# Altium schematic sheet power.SchDoc
size A4; SheetNumber: 5; SheetTotal: 8
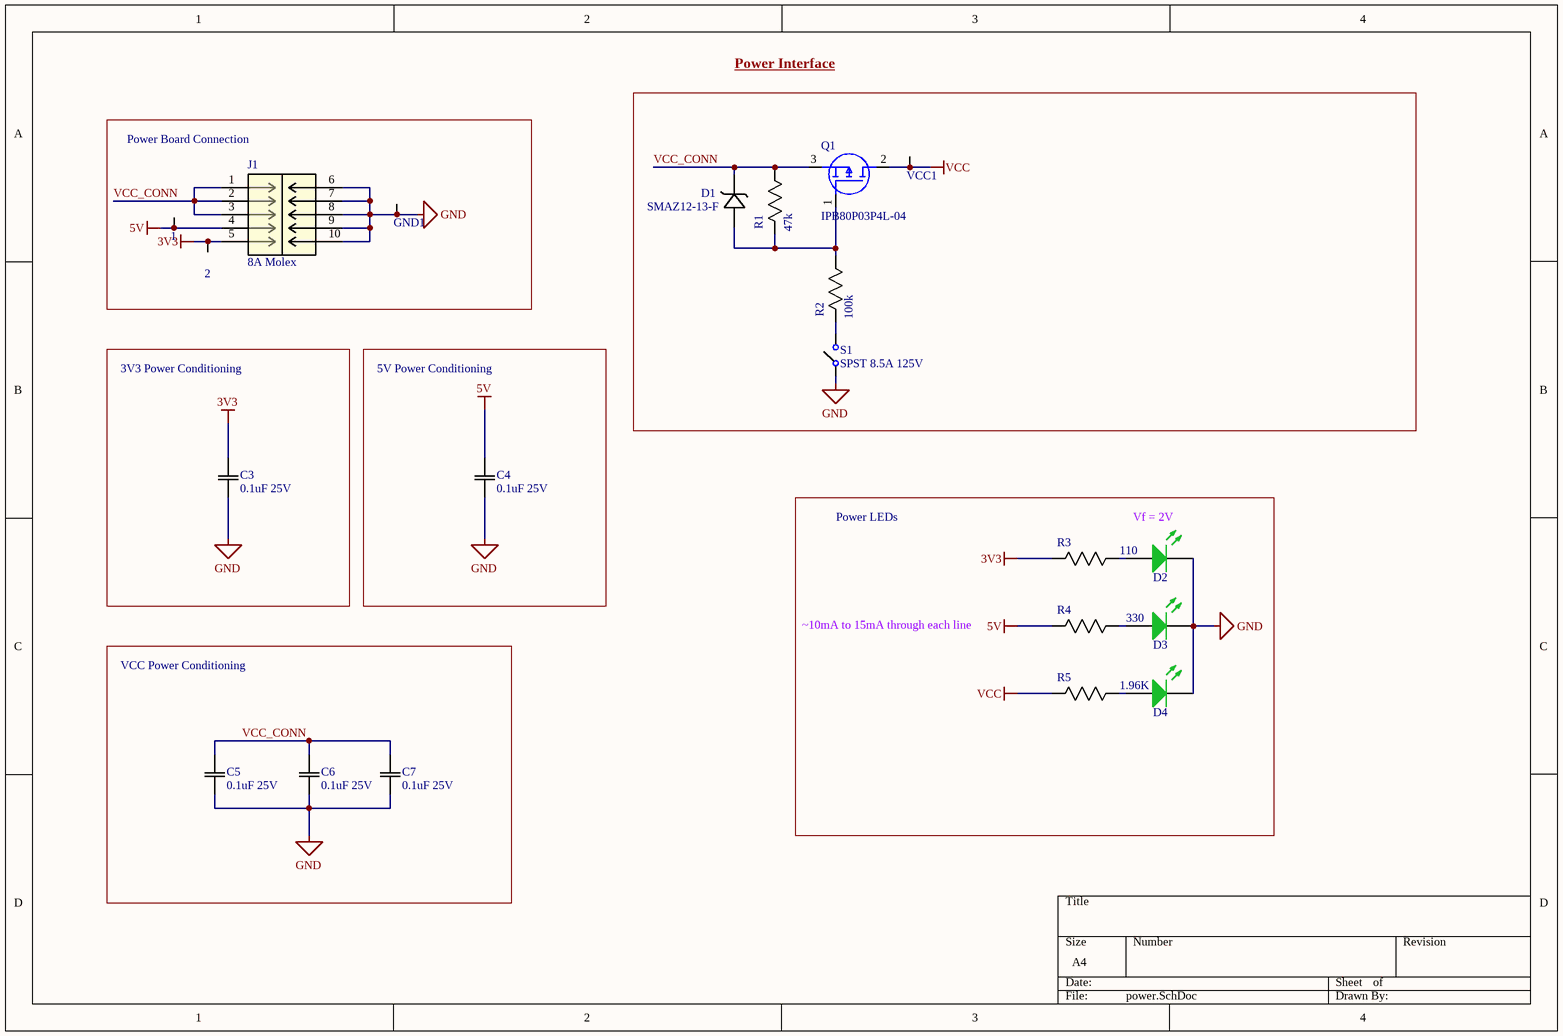
[diagram p0: power.SchDoc]

## Parts
1  Test Point (Via)  [TP]  (value not drawn)
2  Test Point (Via)  [TP]  (value not drawn)
C3  0.1uF 25V  [0805]
C4  0.1uF 25V  [0805]
C5  0.1uF 25V  [0805]
C6  0.1uF 25V  [0805]
C7  0.1uF 25V  [0805]
D1  SMAZ12-13-F  [SMA_DIO-L]
D2  LED2  [3.2X1.6X1.1]  (value not drawn)
D3  LED2  [3.2X1.6X1.1]  (value not drawn)
D4  LED2  [3.2X1.6X1.1]  (value not drawn)
GND1  Test Point (Via)  [TP]  (value not drawn)
J1  8A Molex  [MOLEX_0430451012]
Q1  IPB80P03P4L-04  [IPB80P03P4L04]
R1  47k  [0603]
R2  100k  [0603]
R3  110  [0603]
R4  330  [0603]
R5  1.96K  [0603]
S1  SPST 8.5A 125V  [SPST GF-123-0054]
VCC1  Test Point (Via)  [TP]  (value not drawn)

## Blocks framed on the sheet
Power Board Connection: 1 2 GND1 J1
3V3 Power Conditioning: C3
5V Power Conditioning: C4
VCC Power Conditioning: C5-C7

## Nets
3V3: 2.1 C3.1(C1) J1.5 R3.2(R2)
5V: 1.1 C4.1(C1) J1.4 R4.2(R2)
GND: C3.2(C2) C4.2(C2) C5.2(C2) C6.2(C2) C7.2(C2) D2.2(K) D3.2(K) D4.2(K) GND1.1 J1.6 J1.7 J1.8 J1.9 J1.10 S1.0
VCC: Q1.2(D) R5.2(R2) VCC1.1
VCC_CONN: C5.1(C1) C6.1(C1) C7.1(C1) D1.1 J1.1 J1.2 J1.3 Q1.3(S) R1.1(R1)
NetD1_2: D1.2 Q1.1(G) R1.2(R2) R2.1(R1)
NetD2_1: D2.1(A) R3.1(R1)
NetD3_1: D3.1(A) R4.1(R1)
NetD4_1: D4.1(A) R5.1(R1)
NetR2_2: R2.2(R2) S1.1

## Notes on the sheet
- Power Interface
- Power LEDs
- Vf = 2V
- ~10mA to 15mA through each line

## Library data of the parts
C3-C7 = CAP 0.1uF 25V: CAP CER 0.1UF 25V X7R 0805/0603; Tolerance: 10%; Value: 0.1uF; Temperature Coefficient: X7R; Rating: 25V; Operating Temperature: -55°C ~ 125°C
D1 = DIODE ZENER 12V 1W: Zener Diode 12 V 1 W ±5% Surface Mount SMA; Mfr_Name: Diodes Inc; Type: DEV; Copyright: Copyright (C) 2021 Ultra Librarian. All rights reserved.; Manufacturer_Part_Number: SMAZ12-13-F; Digi-Key_Part_Number_1: SMAZ12-FDICT-ND; Digi-Key_Part_Number_2: SMAZ12-FDIDKR-ND; Digi-Key_Part_Number_3: SMAZ12-FDITR-ND; RefDes: RefDes; Supplier 1: Mouser; Supplier 2: Newark; Supplier 3: Digi-Key; Supplier Part Number 1: 621-SMAZ12-F; Supplier Part Number 2: 23T8541; Supplier Part Number 3: SMAZ12-FDICT-ND
D2-D4 = LED GREEN SMD: Typical RED, GREEN, YELLOW, AMBER GaAs LED; Voltage - Forward (Vf) (Typ): 2V; Lens Transparency: Clear; Current - Test: 20mA; Package: 1206; Color: Green
J1 = CN HDR 10POS MOLEX 0430451012: CONN HEADER VERT 10POS 3MM; Number of Terminals/Pins: 10; Contact Resistance: 10mR; Connector Type: Male Pin; Number of Ports: 1; Max Voltage Rating (AC): 250V; Pitch: 0.118inch; Supplier 1: Digi-Key; Manufacturer: Molex; Manufacturer Part Number: 0430451012; RoHS: Yes; Category: Headers and Wire Housings; Stock 1: 22123; Pricing 1: 1=2.46000, 10=2.09300, 80=1.72925, 1224=1.36521, 6120=1.21049 (USD); Mount: Through Hole; Color: Black; Contact Material: Brass; Contact Plating: Tin; Housing Color: Black; Housing Material: Polymer; Min Operating Temperature: -40°C; Max Operating Temperature: 105°C; Packaging: Tray; Number of Rows: 2; Number of Positions: 10; Termination: Solder; Number of Contacts: 10; Orientation: Straight; Series: Micro-Fit 3.0™ 43045; Fastening Type: Ramp; Contact Type: Male Pin; Length: 19.15mm; Row Spacing: 0.118inch; Depth: 8.77mm; Flammability Rating: UL94 V-0; RoHS Compliant: Yes; ComponentLink1URL: http://components.arrow.com/part/dataview/0323_01052363?src-supplier=Arrow+Europe; ComponentLink1Description: http://components.arrow.com/part/dataview/0323_01052363?src-supplier=Arrow+Europe; ComponentLink2URL: http://components.arrow.com/part/dataview/2943140S3689940N3303?src-supplier=Arrow+Electronics; ComponentLink2Description: http://components.arrow.com/part/dataview/2943140S3689940N3303?src-supplier=Arrow+Electronics; Supplier Part Number 1: WM1793-ND
Q1 = MOSFET IPB80P03P4L-04: P-Channel 30 V 80A (Tc) 137W (Tc) Surface Mount PG-TO263-3-2; Manufacturer_Name: Infineon; Datasheet Link: https://componentsearchengine.com//IPB80P03P4L-04.pdf; Height: 4.5mm; Manufacturer_Part_Number: IPB80P03P4L-04; Mouser Part Number: 726-IPB80P03P4L-04; Mouser Price/Stock: https://www.mouser.co.uk/ProductDetail/Infineon-Technologies/IPB80P03P4L-04?qs=wK%252BoHS4yu562EimsoDeBJQ%3D%3D; Supplier 1: Mouser; Supplier Part Number 1: 726-IPB80P03P4L-04
R1 = RES 47k 1/8W - 5%: RES SMD 47k OHM 5% 1/8W 0805; Power (Watts): 0.125W; Package: 0805; Value: 47k; Tolerance: 5%
R2 = RES 100k 1/8W - 5%: RES SMD 100K OHM 5% 1/8W 0805/0603; Power (Watts): 0.125W; Package: 0805; Value: 100k; Tolerance: 5%
R3 = RES 110.0 1/8W - 1%: RES SMD 110 OHM 1% 1/8W 0805/0603; Power (Watts): 0.125W; Package: 0805; Value: 110; Tolerance: 1%
R4 = RES 330.0 1/8W - 5%: RES SMD 330 OHM 5% 1/8W 0805; Power (Watts): 0.125W; Package: 0805; Value: 330; Tolerance: 5%
R5 = RES 1.96k 1/8W: RES SMD 1.96K OHM 1% 1/8W 0805; Power (Watts): 0.125W; Package: 0805; Value: 1.96k; Tolerance: 1%
S1 = SW SLIDE: SWITCH SLIDE SPST 8.5A 125V; MP: GF-123-0054; MF: CW Industries; Digikey: CWI333-ND; Digikey Link: https://www.digikey.com/en/products/detail/cw-industries/GF-123-0054/4089770; Price: 1.25 CAD; Rating: 8.5A 125V; ComponentLink1Description: Digikey; ComponentLink1URL: https://www.digikey.ca/product-detail/en/zf-electronics/SRB22A2FBBNN/CH755-ND/446021; ComponentLink2Description: Datasheet; ComponentLink2URL: http://switches-sensors.zf.com/us/wp-content/uploads/sites/7/2012/10/Rocker_SRB_Datasheet1.pdf